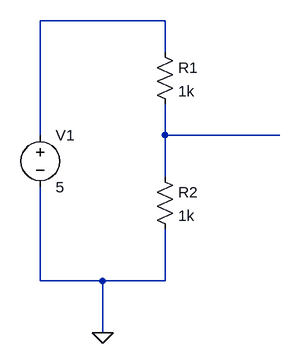
[diagram p0: schematic priklad1.asc]
priklad1.asc, the LTspice schematic file:
Version 4
SHEET 1 880 680
WIRE -32 -208 -224 -208
WIRE -32 -160 -32 -208
WIRE -224 -32 -224 -208
WIRE -32 -32 -32 -80
WIRE 144 -32 -32 -32
WIRE -32 32 -32 -32
WIRE -224 192 -224 48
WIRE -128 192 -224 192
WIRE -32 192 -32 112
WIRE -32 192 -128 192
WIRE -128 272 -128 192
FLAG -128 272 0
SYMBOL voltage -224 -48 R0
WINDOW 123 0 0 Left 2
WINDOW 39 0 0 Left 2
SYMATTR InstName V1
SYMATTR Value 5
SYMBOL res -48 -176 R0
SYMATTR InstName R1
SYMATTR Value 1k
SYMBOL res -48 16 R0
SYMATTR InstName R2
SYMATTR Value 1k

The netlist it stands for:
* priklad1.asc
V1 N001 0 5
R1 N001 N002 1k
R2 N002 0 1k
.backanno
.end